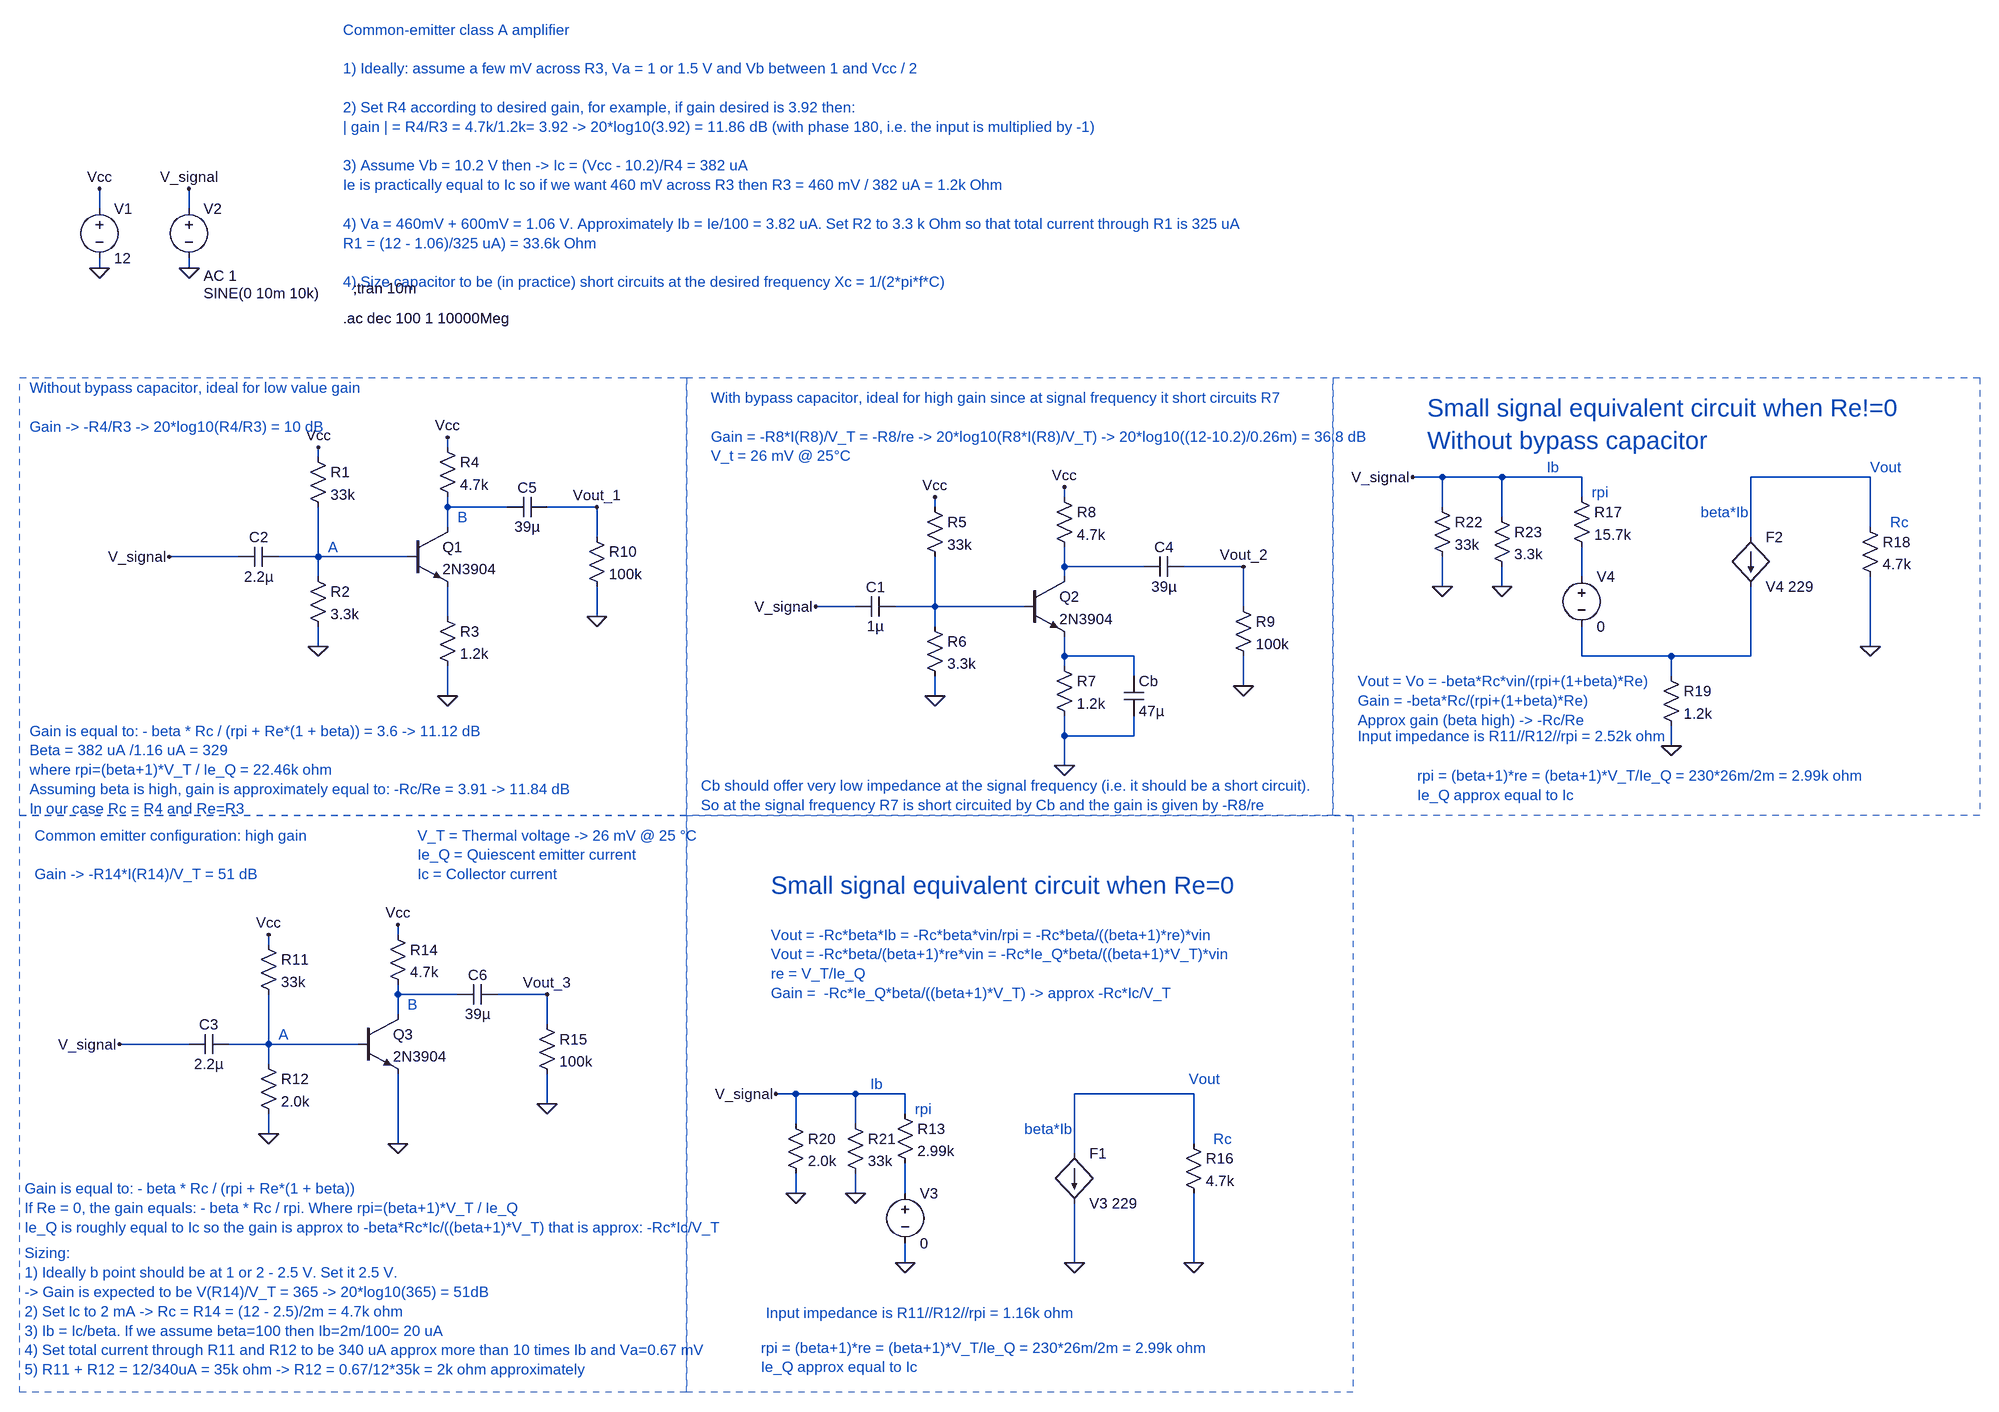
[diagram p0: schematic Common-emitter-amplifier-design.asc]
Common-emitter-amplifier-design.asc, the LTspice schematic file:
Version 4
SHEET 1 3844 1572
WIRE -224 -336 -224 -368
WIRE -80 -336 -80 -368
WIRE -224 -240 -224 -256
WIRE -80 -240 -80 -256
WIRE 336 48 336 32
WIRE 128 64 128 48
WIRE 1936 96 1888 96
WIRE 2032 96 1936 96
WIRE 2160 96 2032 96
WIRE 2624 96 2432 96
WIRE 1328 128 1328 112
WIRE 2160 128 2160 96
WIRE 336 144 336 128
WIRE 432 144 336 144
WIRE 576 144 496 144
WIRE 1120 144 1120 128
WIRE 1936 144 1936 96
WIRE 2032 160 2032 96
WIRE 336 176 336 144
WIRE 2624 176 2624 96
WIRE 576 192 576 144
WIRE 2432 192 2432 96
WIRE 0 224 -112 224
WIRE 128 224 128 144
WIRE 128 224 64 224
WIRE 272 224 128 224
WIRE 1328 240 1328 208
WIRE 1456 240 1328 240
WIRE 1616 240 1520 240
WIRE 128 256 128 224
WIRE 1328 256 1328 240
WIRE 2160 256 2160 208
WIRE 1936 272 1936 224
WIRE 2032 272 2032 240
WIRE 992 304 928 304
WIRE 1120 304 1120 224
WIRE 1120 304 1056 304
WIRE 1264 304 1120 304
WIRE 1616 304 1616 240
WIRE 336 320 336 272
WIRE 576 320 576 272
WIRE 1120 336 1120 304
WIRE 128 368 128 336
WIRE 2624 368 2624 256
WIRE 1328 384 1328 352
WIRE 1440 384 1328 384
WIRE 2160 384 2160 336
WIRE 2304 384 2160 384
WIRE 2432 384 2432 272
WIRE 2432 384 2304 384
WIRE 1328 400 1328 384
WIRE 1440 416 1440 384
WIRE 2304 416 2304 384
WIRE 1616 432 1616 384
WIRE 336 448 336 400
WIRE 1120 448 1120 416
WIRE 1328 512 1328 480
WIRE 1440 512 1440 480
WIRE 1440 512 1328 512
WIRE 2304 528 2304 496
WIRE 1328 560 1328 512
WIRE 256 832 256 816
WIRE 48 848 48 832
WIRE 256 928 256 912
WIRE 352 928 256 928
WIRE 496 928 416 928
WIRE 256 960 256 928
WIRE 496 976 496 928
WIRE -80 1008 -192 1008
WIRE 48 1008 48 928
WIRE 48 1008 -16 1008
WIRE 192 1008 48 1008
WIRE 48 1040 48 1008
WIRE 896 1088 864 1088
WIRE 992 1088 896 1088
WIRE 1072 1088 992 1088
WIRE 1536 1088 1344 1088
WIRE 496 1104 496 1056
WIRE 1072 1120 1072 1088
WIRE 896 1136 896 1088
WIRE 992 1136 992 1088
WIRE 48 1152 48 1120
WIRE 256 1168 256 1056
WIRE 1536 1168 1536 1088
WIRE 1344 1184 1344 1088
WIRE 896 1248 896 1216
WIRE 992 1248 992 1216
WIRE 1072 1248 1072 1200
WIRE 1072 1360 1072 1328
WIRE 1344 1360 1344 1264
WIRE 1536 1360 1536 1248
FLAG -224 -240 0
FLAG -80 -240 0
FLAG 336 448 0
FLAG 128 368 0
FLAG -224 -368 Vcc
FLAG 128 48 Vcc
FLAG 336 32 Vcc
FLAG 1328 560 0
FLAG 1120 448 0
FLAG 1120 128 Vcc
FLAG 1328 112 Vcc
FLAG 1616 432 0
FLAG 576 320 0
FLAG 576 144 Vout_1
FLAG 1616 240 Vout_2
FLAG -80 -368 V_signal
FLAG -112 224 V_signal
FLAG 928 304 V_signal
FLAG 256 1168 0
FLAG 48 1152 0
FLAG 48 832 Vcc
FLAG 256 816 Vcc
FLAG 496 1104 0
FLAG 496 928 Vout_3
FLAG -192 1008 V_signal
FLAG 864 1088 V_signal
FLAG 1072 1360 0
FLAG 1536 1360 0
FLAG 1344 1360 0
FLAG 1888 96 V_signal
FLAG 2304 528 0
FLAG 2624 368 0
FLAG 896 1248 0
FLAG 992 1248 0
FLAG 1936 272 0
FLAG 2032 272 0
SYMBOL voltage -224 -352 R0
WINDOW 123 0 0 Left 0
WINDOW 39 0 0 Left 0
SYMATTR InstName V1
SYMATTR Value 12
SYMBOL voltage -80 -352 R0
WINDOW 3 24 152 Left 2
WINDOW 123 24 124 Left 2
WINDOW 39 0 0 Left 0
SYMATTR Value SINE(0 10m 10k)
SYMATTR Value2 AC 1
SYMATTR InstName V2
SYMBOL res 112 48 R0
SYMATTR InstName R1
SYMATTR Value 33k
SYMBOL res 112 240 R0
SYMATTR InstName R2
SYMATTR Value 3.3k
SYMBOL res 320 304 R0
SYMATTR InstName R3
SYMATTR Value 1.2k
SYMBOL res 320 32 R0
SYMATTR InstName R4
SYMATTR Value 4.7k
SYMBOL npn 272 176 R0
SYMATTR InstName Q1
SYMATTR Value 2N3904
SYMBOL cap 64 208 R90
WINDOW 0 0 32 VBottom 2
WINDOW 3 32 32 VTop 2
SYMATTR InstName C2
SYMATTR Value 2.2µ
SYMBOL res 1104 128 R0
SYMATTR InstName R5
SYMATTR Value 33k
SYMBOL res 1104 320 R0
SYMATTR InstName R6
SYMATTR Value 3.3k
SYMBOL res 1312 384 R0
SYMATTR InstName R7
SYMATTR Value 1.2k
SYMBOL res 1312 112 R0
SYMATTR InstName R8
SYMATTR Value 4.7k
SYMBOL npn 1264 256 R0
SYMATTR InstName Q2
SYMATTR Value 2N3904
SYMBOL cap 1056 288 R90
WINDOW 0 0 32 VBottom 2
WINDOW 3 32 32 VTop 2
SYMATTR InstName C1
SYMATTR Value 1µ
SYMBOL cap 1424 416 R0
SYMATTR InstName Cb
SYMATTR Value 47µ
SYMBOL cap 1520 224 R90
WINDOW 0 0 32 VBottom 2
WINDOW 3 32 32 VTop 2
SYMATTR InstName C4
SYMATTR Value 39µ
SYMBOL res 1600 288 R0
SYMATTR InstName R9
SYMATTR Value 100k
SYMBOL cap 496 128 R90
WINDOW 0 0 32 VBottom 2
WINDOW 3 32 32 VTop 2
SYMATTR InstName C5
SYMATTR Value 39µ
SYMBOL res 560 176 R0
SYMATTR InstName R10
SYMATTR Value 100k
SYMBOL res 32 832 R0
SYMATTR InstName R11
SYMATTR Value 33k
SYMBOL res 32 1024 R0
SYMATTR InstName R12
SYMATTR Value 2.0k
SYMBOL res 240 816 R0
SYMATTR InstName R14
SYMATTR Value 4.7k
SYMBOL npn 192 960 R0
SYMATTR InstName Q3
SYMATTR Value 2N3904
SYMBOL cap -16 992 R90
WINDOW 0 0 32 VBottom 2
WINDOW 3 32 32 VTop 2
SYMATTR InstName C3
SYMATTR Value 2.2µ
SYMBOL cap 416 912 R90
WINDOW 0 0 32 VBottom 2
WINDOW 3 32 32 VTop 2
SYMATTR InstName C6
SYMATTR Value 39µ
SYMBOL res 480 960 R0
SYMATTR InstName R15
SYMATTR Value 100k
SYMBOL res 1056 1104 R0
SYMATTR InstName R13
SYMATTR Value 2.99k
SYMBOL voltage 1072 1232 R0
WINDOW 123 0 0 Left 0
WINDOW 39 0 0 Left 0
SYMATTR InstName V3
SYMATTR Value 0
SYMBOL f 1344 1184 R0
SYMATTR InstName F1
SYMATTR Value V3 229
SYMBOL res 1520 1152 R0
SYMATTR InstName R16
SYMATTR Value 4.7k
SYMBOL res 2144 112 R0
SYMATTR InstName R17
SYMATTR Value 15.7k
SYMBOL voltage 2160 240 R0
WINDOW 123 0 0 Left 0
WINDOW 39 0 0 Left 0
SYMATTR InstName V4
SYMATTR Value 0
SYMBOL f 2432 192 R0
SYMATTR InstName F2
SYMATTR Value V4 229
SYMBOL res 2608 160 R0
SYMATTR InstName R18
SYMATTR Value 4.7k
SYMBOL res 2288 400 R0
SYMATTR InstName R19
SYMATTR Value 1.2k
SYMBOL res 880 1120 R0
SYMATTR InstName R20
SYMATTR Value 2.0k
SYMBOL res 976 1120 R0
SYMATTR InstName R21
SYMATTR Value 33k
SYMBOL res 1920 128 R0
SYMATTR InstName R22
SYMATTR Value 33k
SYMBOL res 2016 144 R0
SYMATTR InstName R23
SYMATTR Value 3.3k
TEXT 168 -160 Left 2 !.ac dec 100 1 10000Meg
TEXT -336 -48 Left 2 ;Without bypass capacitor, ideal for low value gain\n \nGain -> -R4/R3 -> 20*log10(R4/R3) = 10 dB
TEXT 760 -32 Left 2 ;With bypass capacitor, ideal for high gain since at signal frequency it short circuits R7\n \nGain = -R8*I(R8)/V_T = -R8/re -> 20*log10(R8*I(R8)/V_T) -> 20*log10((12-10.2)/0.26m) = 36.8 dB\nV_t = 26 mV @ 25°C
TEXT 168 -624 Left 2 ;Common-emitter class A amplifier\n \n1) Ideally: assume a few mV across R3, Va = 1 or 1.5 V and Vb between 1 and Vcc / 2\n \n2) Set R4 according to desired gain, for example, if gain desired is 3.92 then:\n| gain | = R4/R3 = 4.7k/1.2k= 3.92 -> 20*log10(3.92) = 11.86 dB (with phase 180, i.e. the input is multiplied by -1)\n \n3) Assume Vb = 10.2 V then -> Ic = (Vcc - 10.2)/R4 = 382 uA\nIe is practically equal to Ic so if we want 460 mV across R3 then R3 = 460 mV / 382 uA = 1.2k Ohm\n \n4) Va = 460mV + 600mV = 1.06 V. Approximately Ib = Ie/100 = 3.82 uA. Set R2 to 3.3 k Ohm so that total current through R1 is 325 uA\nR1 = (12 - 1.06)/325 uA) = 33.6k Ohm\n \n4) Size capacitor to be (in practice) short circuits at the desired frequency Xc = 1/(2*pi*f*C)
TEXT 144 208 Left 2 ;A
TEXT 352 160 Left 2 ;B
TEXT 184 -208 Left 2 !;tran 10m
TEXT 744 592 Left 2 ;Cb should offer very low impedance at the signal frequency (i.e. it should be a short circuit).\nSo at the signal frequency R7 is short circuited by Cb and the gain is given by -R8/re
TEXT -336 504 Left 2 ;Gain is equal to: - beta * Rc / (rpi + Re*(1 + beta)) = 3.6 -> 11.12 dB\nBeta = 382 uA /1.16 uA = 329\nwhere rpi=(beta+1)*V_T / Ie_Q = 22.46k ohm\nAssuming beta is high, gain is approximately equal to: -Rc/Re = 3.91 -> 11.84 dB\nIn our case Rc = R4 and Re=R3
TEXT -328 672 Left 2 ;Common emitter configuration: high gain\n \nGain -> -R14*I(R14)/V_T = 51 dB
TEXT 64 992 Left 2 ;A
TEXT 272 944 Left 2 ;B
TEXT -344 1240 Left 2 ;Gain is equal to: - beta * Rc / (rpi + Re*(1 + beta))\nIf Re = 0, the gain equals: - beta * Rc / rpi. Where rpi=(beta+1)*V_T / Ie_Q\nIe_Q is roughly equal to Ic so the gain is approx to -beta*Rc*Ic/((beta+1)*V_T) that is approx: -Rc*Ic/V_T
TEXT 288 672 Left 2 ;V_T = Thermal voltage -> 26 mV @ 25 °C\nIe_Q = Quiescent emitter current\nIc = Collector current
TEXT -344 1344 Left 2 ;Sizing:\n1) Ideally b point should be at 1 or 2 - 2.5 V. Set it 2.5 V.\n-> Gain is expected to be V(R14)/V_T = 365 -> 20*log10(365) = 51dB\n2) Set Ic to 2 mA -> Rc = R14 = (12 - 2.5)/2m = 4.7k ohm\n3) Ib = Ic/beta. If we assume beta=100 then Ib=2m/100= 20 uA\n4) Set total current through R11 and R12 to be 340 uA approx more than 10 times Ib and Va=0.67 mV\n5) R11 + R12 = 12/340uA = 35k ohm -> R12 = 0.67/12*35k = 2k ohm approximately
TEXT 1568 1160 Left 2 ;Rc
TEXT 1264 1144 Left 2 ;beta*Ib
TEXT 1016 1072 Left 2 ;Ib
TEXT 1088 1112 Left 2 ;rpi
TEXT 840 1496 Left 2 ;rpi = (beta+1)*re = (beta+1)*V_T/Ie_Q = 230*26m/2m = 2.99k ohm\nIe_Q approx equal to Ic
TEXT 1528 1064 Left 2 ;Vout
TEXT 856 752 Left 4 ;Small signal equivalent circuit when Re=0
TEXT 2656 168 Left 2 ;Rc
TEXT 2352 152 Left 2 ;beta*Ib
TEXT 2104 80 Left 2 ;Ib
TEXT 2176 120 Left 2 ;rpi
TEXT 2624 80 Left 2 ;Vout
TEXT 1896 576 Left 2 ;rpi = (beta+1)*re = (beta+1)*V_T/Ie_Q = 230*26m/2m = 2.99k ohm\nIe_Q approx equal to Ic
TEXT 1912 -16 Left 4 ;Small signal equivalent circuit when Re!=0\nWithout bypass capacitor
TEXT 856 832 Left 2 ;Vout = -Rc*beta*Ib = -Rc*beta*vin/rpi = -Rc*beta/((beta+1)*re)*vin\nVout = -Rc*beta/(beta+1)*re*vin = -Rc*Ie_Q*beta/((beta+1)*V_T)*vin\nre = V_T/Ie_Q\nGain =  -Rc*Ie_Q*beta/((beta+1)*V_T) -> approx -Rc*Ic/V_T
TEXT 848 1440 Left 2 ;Input impedance is R11//R12//rpi = 1.16k ohm
TEXT 1800 512 Left 2 ;Input impedance is R11//R12//rpi = 2.52k ohm
TEXT 1800 424 Left 2 ;Vout = Vo = -beta*Rc*vin/(rpi+(1+beta)*Re)\nGain = -beta*Rc/(rpi+(1+beta)*Re)\nApprox gain (beta high) -> -Rc/Re
RECTANGLE Normal 720 640 -352 -64 2
RECTANGLE Normal 1760 640 720 -64 2
RECTANGLE Normal 720 1568 -352 640 2
RECTANGLE Normal 1792 1568 720 640 2
RECTANGLE Normal 2800 640 1760 -64 2

The netlist it stands for:
* Common-emitter-amplifier-design.asc
V1 Vcc 0 12
V2 V_signal 0 SINE(0 10m 10k) AC 1
R1 Vcc N003 33k
R2 N003 0 3.3k
R3 N007 0 1.2k
R4 Vcc N002 4.7k
Q1 N002 N003 N007 0 2N3904
C2 N003 V_signal 2.2µ
R5 Vcc N006 33k
R6 N006 0 3.3k
R7 N008 0 1.2k
R8 Vcc N004 4.7k
Q2 N004 N006 N008 0 2N3904
C1 N006 V_signal 1µ
Cb N008 0 47µ
C4 Vout_2 N004 39µ
R9 Vout_2 0 100k
C5 Vout_1 N002 39µ
R10 Vout_1 0 100k
R11 Vcc N011 33k
R12 N011 0 2.0k
R14 Vcc N010 4.7k
Q3 N010 N011 0 0 2N3904
C3 N011 V_signal 2.2µ
C6 Vout_3 N010 39µ
R15 Vout_3 0 100k
R13 V_signal N013 2.99k
V3 N013 0 0
F1 N012 0 V3 229
R16 N012 0 4.7k
R17 V_signal N005 15.7k
V4 N005 N009 0
F2 N001 N009 V4 229
R18 N001 0 4.7k
R19 N009 0 1.2k
R20 V_signal 0 2.0k
R21 V_signal 0 33k
R22 V_signal 0 33k
R23 V_signal 0 3.3k
.model NPN NPN
.model PNP PNP
.lib standard.bjt
.ac dec 100 1 10000Meg
* Without bypass capacitor, ideal for low value gain
* Gain -> -R4/R3 -> 20*log10(R4/R3) = 10 dB
* With bypass capacitor, ideal for high gain since at signal frequency it short circuits R7
* Gain = -R8*I(R8)/V_T = -R8/re -> 20*log10(R8*I(R8)/V_T) -> 20*log10((12-10.2)/0.26m) = 36.8 dB
* V_t = 26 mV @ 25°C
* Common-emitter class A amplifier
* 1) Ideally: assume a few mV across R3, Va = 1 or 1.5 V and Vb between 1 and Vcc / 2
* 2) Set R4 according to desired gain, for example, if gain desired is 3.92 then:
* | gain | = R4/R3 = 4.7k/1.2k= 3.92 -> 20*log10(3.92) = 11.86 dB (with phase 180, i.e. the input is multiplied by -1)
* 3) Assume Vb = 10.2 V then -> Ic = (Vcc - 10.2)/R4 = 382 uA
* Ie is practically equal to Ic so if we want 460 mV across R3 then R3 = 460 mV / 382 uA = 1.2k Ohm
* 4) Va = 460mV + 600mV = 1.06 V. Approximately Ib = Ie/100 = 3.82 uA. Set R2 to 3.3 k Ohm so that total current through R1 is 325 uA
* R1 = (12 - 1.06)/325 uA) = 33.6k Ohm
* 4) Size capacitor to be (in practice) short circuits at the desired frequency Xc = 1/(2*pi*f*C)
* A
* B
;tran 10m
* Cb should offer very low impedance at the signal frequency (i.e. it should be a short circuit).
* So at the signal frequency R7 is short circuited by Cb and the gain is given by -R8/re
* Gain is equal to: - beta * Rc / (rpi + Re*(1 + beta)) = 3.6 -> 11.12 dB
* Beta = 382 uA /1.16 uA = 329
* where rpi=(beta+1)*V_T / Ie_Q = 22.46k ohm
* Assuming beta is high, gain is approximately equal to: -Rc/Re = 3.91 -> 11.84 dB
* In our case Rc = R4 and Re=R3
* Common emitter configuration: high gain
* Gain -> -R14*I(R14)/V_T = 51 dB
* A
* B
* Gain is equal to: - beta * Rc / (rpi + Re*(1 + beta))
* If Re = 0, the gain equals: - beta * Rc / rpi. Where rpi=(beta+1)*V_T / Ie_Q
* Ie_Q is roughly equal to Ic so the gain is approx to -beta*Rc*Ic/((beta+1)*V_T) that is approx: -Rc*Ic/V_T
* V_T = Thermal voltage -> 26 mV @ 25 °C
* Ie_Q = Quiescent emitter current
* Ic = Collector current
* Sizing:
* 1) Ideally b point should be at 1 or 2 - 2.5 V. Set it 2.5 V.
* -> Gain is expected to be V(R14)/V_T = 365 -> 20*log10(365) = 51dB
* 2) Set Ic to 2 mA -> Rc = R14 = (12 - 2.5)/2m = 4.7k ohm
* 3) Ib = Ic/beta. If we assume beta=100 then Ib=2m/100= 20 uA
* 4) Set total current through R11 and R12 to be 340 uA approx more than 10 times Ib and Va=0.67 mV
* 5) R11 + R12 = 12/340uA = 35k ohm -> R12 = 0.67/12*35k = 2k ohm approximately
* Rc
* beta*Ib
* Ib
* rpi
* rpi = (beta+1)*re = (beta+1)*V_T/Ie_Q = 230*26m/2m = 2.99k ohm
* Ie_Q approx equal to Ic
* Vout
* Small signal equivalent circuit when Re=0
* Rc
* beta*Ib
* Ib
* rpi
* Vout
* rpi = (beta+1)*re = (beta+1)*V_T/Ie_Q = 230*26m/2m = 2.99k ohm
* Ie_Q approx equal to Ic
* Small signal equivalent circuit when Re!=0
* Without bypass capacitor
* Vout = -Rc*beta*Ib = -Rc*beta*vin/rpi = -Rc*beta/((beta+1)*re)*vin
* Vout = -Rc*beta/(beta+1)*re*vin = -Rc*Ie_Q*beta/((beta+1)*V_T)*vin
* re = V_T/Ie_Q
* Gain =  -Rc*Ie_Q*beta/((beta+1)*V_T) -> approx -Rc*Ic/V_T
* Input impedance is R11//R12//rpi = 1.16k ohm
* Input impedance is R11//R12//rpi = 2.52k ohm
* Vout = Vo = -beta*Rc*vin/(rpi+(1+beta)*Re)
* Gain = -beta*Rc/(rpi+(1+beta)*Re)
* Approx gain (beta high) -> -Rc/Re
.backanno
.end